# Altium project WT-METER-2CH.PrjPcb (part 2 of 2)

## Sheet [5] - RS485-TRANSCEIVER.SchDoc
size A
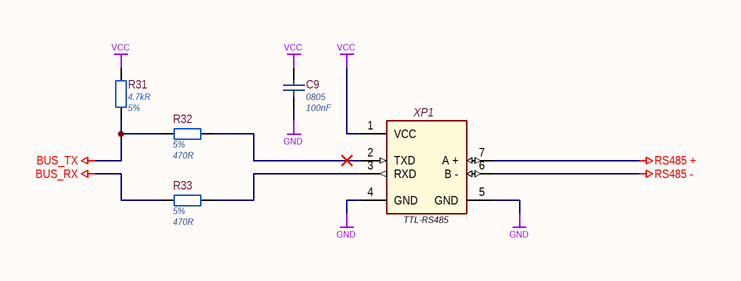
[diagram p3: [5] - RS485-TRANSCEIVER.SchDoc]

### Parts
C9  Case/Package: 0805  Capacitance: 100nF  [CH0805C]  (hidden comment: AC0805KRX7R9BB104)
R31  Resistance: 4.7kR  Tolerance: 5%  [CH0805R]  (hidden comment: RC0805JR-074K7L)
R32  Tolerance: 5%  Resistance: 470R  [CH0805R]  (hidden comment: RC0805JR-07470RL)
R33  Tolerance: 5%  Resistance: 470R  [CH0805R]  (hidden comment: RC0805JR-07470RL)
XP1  TTL-RS485  [TTL-RS485]

### Nets
BUS_RX: R33.1
BUS_TX: R31.2 R32.1
GND: C9.2 XP1.4(GND) XP1.5(GND)
RS485 +: XP1.7(A_+)
RS485 -: XP1.6(B_-)
VCC: C9.1 R31.1 XP1.1(VCC)
NetR32_2: R32.2 XP1.2(TXD)
NetR33_2: R33.2 XP1.3(RXD)

### Library data of the parts
C9 = AC0805KRX7R9BB104: 0.10µF 50V Ceramic Capacitor X7R 0805 (2012 Metric) 0.079" L x 0.049" W (2.00mm x 1.25mm); Manufacturer 1: Yageo; Tolerance: 10%; Supplier 1: Digi-Key; Manufacturer Part Number 1: AC0805KRX7R9BB104; Stock 1: 18765; Pricing 1: 1=0.23000, 10=0.15600, 100=0.07930, 500=0.05424, 1000=0.04799 (USD); RoHS: Yes; Mount: Surface Mount; Min Operating Temperature: -55°C; Max Operating Temperature: 125°C; Packaging: Tape and Reel; Voltage Rating: 50V; Length: 0.079inch; Width: 0.049inch; Thickness: 0.028inch; Ratings: AEC-Q200; Lead Free: Lead Free; ComponentLink1URL: http://www.yageo.com/documents/recent/UPY-AC_NP0X7R_16V-to-630V_12.pdf?src-supplier=Digi-Key; ComponentLink1Description: http://www.yageo.com/documents/recent/UPY-AC_NP0X7R_16V-to-630V_12.pdf?src-supplier=Digi-Key; Supplier Part Number 1: 311-3037-1-ND; Supplier 2: Digi-Key; Supplier Part Number 2: 311-1939-2-ND
R31 = RC0805JR-074K7L: RES SMD 4.7K OHM 5% 1/8W 0805; Manufacturer 1: Yageo; Temperature Coefficient: 100ppm/°C; Power Rating: 125mW; Voltage Rating: 150V; Supplier 1: Digi-Key; Manufacturer Part Number 1: RC0805JR-074K7L; Stock 1: 3389846; Pricing 1: 1=0.10000, 10=0.03600, 100=0.01460, 1000=0.00654, 2500=0.00568 (USD); RoHS: Yes; Case/Package: Molded; Contact Plating: Tin,Lead,Matte; Case Code (Imperial): 0805; Case Code (Metric): 2012; Min Operating Temperature: -55°C; Max Operating Temperature: 155°C; Composition: Thick Film; Packaging: Tape and Reel; Termination: SMD/SMT; Military Standard: Not; Length: 2mm; Depth: 1.25mm; Radiation Hardening: No; REACH SVHC: Unknown; Lead Free: Lead Free; ComponentLink1URL: https://datasheet.ciiva.com/7941/442941-7941974.pdf?src-supplier=Element14; ComponentLink1Description: https://datasheet.ciiva.com/7941/442941-7941974.pdf?src-supplier=Element14; ComponentLink2URL: https://datasheet.ciiva.com/7941/442941-7941973.pdf?src-supplier=Element14; ComponentLink2Description: https://datasheet.ciiva.com/7941/442941-7941973.pdf?src-supplier=Element14; ComponentLink3URL: https://datasheet.ciiva.com/17486/rc0805-17486827.pdf?src-supplier=Future+Electronics; ComponentLink3Description: https://datasheet.ciiva.com/17486/rc0805-17486827.pdf?src-supplier=Future+Electronics; ComponentLink4URL: https://datasheet.ciiva.com/12667/rc0805-12667037.pdf?src-supplier=Mouser; ComponentLink4Description: https://datasheet.ciiva.com/12667/rc0805-12667037.pdf?src-supplier=Mouser; Supplier Part Number 1: 311-4.7KARCT-ND
R32 R33 = RC0805JR-07470RL: RES SMD 470 OHM 5% 1/8W 0805; Manufacturer 1: Yageo; Power Rating: 125mW; Temperature Coefficient: 100ppm/°C; Voltage Rating: 150V; Supplier 1: Digi-Key; Manufacturer Part Number 1: RC0805JR-07470RL; Stock 1: 1884733; Pricing 1: 1=0.10000, 10=0.03600, 100=0.01460, 1000=0.00654, 2500=0.00568 (USD); RoHS: Yes; Case/Package: 0805; Contact Plating: Tin,Matte,Lead; Case Code (Imperial): 0805; Case Code (Metric): 2012; Min Operating Temperature: -55°C; Max Operating Temperature: 155°C; Packaging: Tape and Reel; Composition: Thick Film; Termination: SMD/SMT; Military Standard: Not; Length: 2mm; Depth: 1.25mm; Radiation Hardening: No; REACH SVHC: Unknown; Lead Free: Lead Free; ComponentLink1URL: https://datasheet.ciiva.com/2456/rc080520pb20free-2456048.pdf?src-supplier=Digi-Key; ComponentLink1Description: https://datasheet.ciiva.com/2456/rc080520pb20free-2456048.pdf?src-supplier=Digi-Key; ComponentLink2URL: https://datasheet.ciiva.com/15190/getdatasheetpartid-330937-15190054.pdf?src-supplier=Verical; ComponentLink2Description: https://datasheet.ciiva.com/15190/getdatasheetpartid-330937-15190054.pdf?src-supplier=Verical; ComponentLink3URL: https://datasheet.ciiva.com/12667/rc0805-12667416.pdf?src-supplier=Mouser; ComponentLink3Description: https://datasheet.ciiva.com/12667/rc0805-12667416.pdf?src-supplier=Mouser; ComponentLink4URL: https://datasheet.ciiva.com/16740/rc0805-16740745.pdf?src-supplier=Future+Electronics; ComponentLink4Description: https://datasheet.ciiva.com/16740/rc0805-16740745.pdf?src-supplier=Future+Electronics; ComponentLink5URL: https://datasheet.ciiva.com/7941/442941-7941965.pdf?src-supplier=Element14; ComponentLink5Description: https://datasheet.ciiva.com/7941/442941-7941965.pdf?src-supplier=Element14; ComponentLink6URL: https://datasheet.ciiva.com/7941/442941-7941966.pdf?src-supplier=Element14; ComponentLink6Description: https://datasheet.ciiva.com/7941/442941-7941966.pdf?src-supplier=Element14; ComponentLink7URL: https://datasheet.ciiva.com/46395/444164-46395134.pdf?src-supplier=Element14; ComponentLink7Description: https://datasheet.ciiva.com/46395/444164-46395134.pdf?src-supplier=Element14; Supplier Part Number 1: 311-470ARCT-ND
XP1 = TTL-RS485: UART TTL to RS485 Two-way Converter Module; MPN: *; Manufacturer: *; ComponentLinkURL: https://www.amphenol-icc.com/media/wysiwyg/files/drawing/10051922.pdf; Supplier 1: *; Supplier 2: *; PackageReference: TTL-RS485; Value: TTL-RS485

## Sheet [6] - POWER.SchDoc
size A
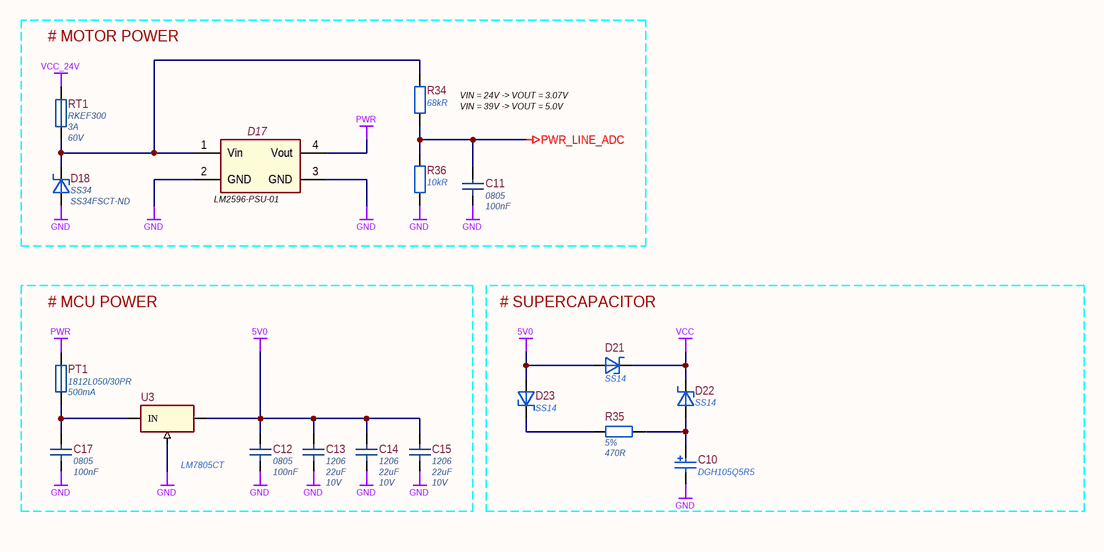
[diagram p4: [6] - POWER.SchDoc]

### Parts
C10  DGH105Q5R5  [DGH105Q5R5]
C11  Case/Package: 0805  Capacitance: 100nF  [CH0805C]  (hidden comment: AC0805KRX7R9BB104)
C12  Case/Package: 0805  Capacitance: 100nF  [CH0805C]  (hidden comment: AC0805KRX7R9BB104)
C13  Case/Package: 1206  Capacitance: 22uF  Voltage Rating: 10V  [CH1206C]  (hidden comment: CC1206KKX5R6BB226)
C14  Case/Package: 1206  Capacitance: 22uF  Voltage Rating: 10V  [CH1206C]  (hidden comment: CC1206KKX5R6BB226)
C15  Case/Package: 1206  Capacitance: 22uF  Voltage Rating: 10V  [CH1206C]  (hidden comment: CC1206KKX5R6BB226)
C17  Case/Package: 0805  Capacitance: 100nF  [CH0805C]  (hidden comment: AC0805KRX7R9BB104)
D17  LM2596-PSU-01  [LM2596-PSU-01]
D18  SS34  Supplier Part Number 1: SS34FSCT-ND  [SMB]
D21  SS14  [SMA]
D22  SS14  [SMA]
D23  SS14  [SMA]
PT1  1812L050/30PR  Hold Current: 500mA  [CH1812F]
R34  Resistance: 68kR  [CH0805R]  (hidden comment: RC0805JR-0768KL)
R35  Tolerance: 5%  Resistance: 470R  [CH0805R]  (hidden comment: RC0805JR-07470RL)
R36  Resistance: 10kR  [CH0805R]  (hidden comment: RC0805JR-0710KL)
RT1  RKEF300  Hold Current: 3A  Voltage Rating: 60V  [RKEF300]
U3  LM7805CT  [TO-220F]

### Blocks framed on the sheet
# MOTOR POWER: C11 D17 D18 R34 R36 RT1
# MCU POWER: C12-C15 C17 PT1 U3
# SUPERCAPACITOR: C10 D21-D23 R35

### Nets
5V0: C12.1 C13.1 C14.1 C15.1 D21.1(A) D23.1(A) U3.3(OUT)
GND: C10.2 C11.2 C12.2 C13.2 C14.2 C15.2 C17.2 D17.2(GND) D17.3(GND) D18.1(A) R36.1 U3.2(GND)
PWR: D17.4(Vout) PT1.1
PWR_LINE_ADC: C11.1 R34.1 R36.2
VCC: D21.2(K) D22.2(K)
VCC_24V: RT1.1
NetC10_1: C10.1 D22.1(A) R35.1
NetC17_1: C17.1 PT1.2 U3.1(IN)
NetD17_1: D17.1(Vin) D18.2(K) R34.2 RT1.2
NetD23_2: D23.2(K) R35.2

### Notes on the sheet
- (near R34) VIN = 24V -> VOUT = 3.07V
  VIN = 39V -> VOUT = 5.0V

### Library data of the parts
C10 = DGH105Q5R5: CAPACITOR 1F -10% +30% 5.5V TH; Manufacturer 1: CDE Illinois Capacitor; Supplier 1: Digi-Key; Manufacturer Part Number 1: DGH105Q5R5; Stock 1: 7797; Pricing 1: 1=2.84000, 10=2.29600, 100=1.75350, 500=1.33600, 1000=1.16900, 2500=1.12725, 5000=1.08550 (USD); RoHS: No; ComponentLink1URL: http://www.illinoiscapacitor.com/pdf/seriesDocuments/DGH%20series.pdf?src-supplier=Digi-Key; ComponentLink1Description: http://www.illinoiscapacitor.com/pdf/seriesDocuments/DGH%20series.pdf?src-supplier=Digi-Key; Supplier Part Number 1: 1572-1771-ND
C11 C12 C17 = AC0805KRX7R9BB104: as C9 on sheet [5] - RS485-TRANSCEIVER; Supplier 1: Digi-Key; Manufacturer Part Number 1: AC0805KRX7R9BB104; Stock 1: 18765; Pricing 1: 1=0.23000, 10=0.15600, 100=0.07930, 500=0.05424, 1000=0.04799 (USD); RoHS: Yes; Mount: Surface Mount; Min Operating Temperature: -55°C; Max Operating Temperature: 125°C; Packaging: Tape and Reel; Voltage Rating: 50V; Length: 0.079inch; Width: 0.049inch; Thickness: 0.028inch; Ratings: AEC-Q200; Lead Free: Lead Free; ComponentLink1URL: http://www.yageo.com/documents/recent/UPY-AC_NP0X7R_16V-to-630V_12.pdf?src-supplier=Digi-Key; ComponentLink1Description: http://www.yageo.com/documents/recent/UPY-AC_NP0X7R_16V-to-630V_12.pdf?src-supplier=Digi-Key; Supplier Part Number 1: 311-3037-1-ND; Supplier 2: Digi-Key; Supplier Part Number 2: 311-1939-2-ND
C13-C15 = CC1206KKX5R6BB226: Cap Ceramic 22uF 10V X5R 10% SMD 1206 85C Blister T/R; Manufacturer 1: Yageo; Supplier 1: Digi-Key; Manufacturer Part Number 1: CC1206KKX5R6BB226; Stock 1: 8000; Pricing 1: 2000=0.23250 (USD); RoHS: Yes; Mount: Surface Mount; Weight: 0.000571oz; Case Code (Imperial): 1206; Case Code (Metric): 3216; Min Operating Temperature: -55°C; Max Operating Temperature: 85°C; Tolerance: 10%; Dielectric: X5R; Packaging: Tape and Reel; Voltage Rating (DC): 10V; Termination: SMD/SMT; Composition: Ceramic; Length: 3.2mm; Depth: 1.6mm; Width: 1.6mm; Thickness: 0.071inch; Radiation Hardening: No; Lead Free: Lead Free; Halogen Free: Halogen Free; ComponentLink1URL: https://datasheet.ciiva.com/13209/upy-gp-np0-16v-to-50v-8-13209975.pdf?src-supplier=Mouser; ComponentLink1Description: https://datasheet.ciiva.com/13209/upy-gp-np0-16v-to-50v-8-13209975.pdf?src-supplier=Mouser; Supplier Part Number 1: 311-1939-2-ND
D17 = LM2596-PSU-01: LM2596 DC-DC Step Down Adjustable PSU Module; MPN: *; Manufacturer: *; Supplier 1: https://www.minikits.com.au/LM2596-PSU-01; Supplier 2: *; PackageReference: LM2596-PSU-01; Value: LM2596-PSU-01; ComponentLink1Description: linck; ComponentLink1URL: https://www.minikits.com.au/LM2596-PSU-01
D18 = SS34: DIODE SCHOTTKY 40V 3A SMC; Manufacturer 1: ON Semiconductor / Fairchild; Element Configuration: Single; Peak Reverse Current: 500uA; Max Forward Surge Current (Ifsm): 100A; Forward Voltage: 500mV; Polarity: Standard; Max Power Dissipation: 2.27W; Number of Elements: 1; Supplier 1: Digi-Key; Manufacturer Part Number 1: SS34; Stock 1: 29298; Pricing 1: 1=0.47000, 10=0.40600, 100=0.30310, 500=0.23816, 1000=0.18403 (USD); RoHS: Yes; Mount: Surface Mount; Case/Package: SMC; Number of Pins: 2; Contact Plating: Tin; Number of Terminals: 2; Min Operating Temperature: -55°C; Max Operating Temperature: 150°C; Packaging: Tape and Reel; Package Quantity: 1; Current Rating: 3A; Voltage Rating (DC): 40V; Forward Current: 3A; Max Repetitive Reverse Voltage (Vrrm): 40V; Output Current: 3A; Peak Non-Repetitive Surge Current: 100A; Average Rectified Current: 3A; Max Reverse Voltage (DC): 40V; Max Surge Current: 100A; Max Reverse Leakage Current: 500uA; Current: 3A; Voltage: 40V; Length: 7.15mm; Height: 2.75mm; Width: 6.25mm; Radiation Hardening: No; Lead Free: Lead Free; REACH SVHC: No SVHC; ComponentLink1URL: https://datasheet.ciiva.com/911/ss34-911088.pdf?src-supplier=Avnet; ComponentLink1Description: https://datasheet.ciiva.com/911/ss34-911088.pdf?src-supplier=Avnet; ComponentLink2URL: https://datasheet.ciiva.com/4715/ss34-197057-4715255.pdf?src-supplier=Mouser; ComponentLink2Description: https://datasheet.ciiva.com/4715/ss34-197057-4715255.pdf?src-supplier=Mouser; ComponentLink3URL: https://datasheet.ciiva.com/34301/1090087-34301975.pdf?src-supplier=Jameco; ComponentLink3Description: https://datasheet.ciiva.com/34301/1090087-34301975.pdf?src-supplier=Jameco; ComponentLink4URL: https://datasheet.ciiva.com/23832/1725604-23832651.pdf?src-supplier=Newark; ComponentLink4Description: https://datasheet.ciiva.com/23832/1725604-23832651.pdf?src-supplier=Newark; ComponentLink5URL: https://datasheet.ciiva.com/34302/1547649-34302462.pdf?src-supplier=Jameco; ComponentLink5Description: https://datasheet.ciiva.com/34302/1547649-34302462.pdf?src-supplier=Jameco; ComponentLink6URL: https://datasheet.ciiva.com/911/ss34-911086.pdf?src-supplier=Digi-Key; ComponentLink6Description: https://datasheet.ciiva.com/911/ss34-911086.pdf?src-supplier=Digi-Key; ComponentLink7URL: https://datasheet.ciiva.com/8300/ss39-8300583.pdf?src-supplier=Avnet; ComponentLink7Description: https://datasheet.ciiva.com/8300/ss39-8300583.pdf?src-supplier=Avnet; ComponentLink8URL: https://datasheet.ciiva.com/911/ss34-911085.pdf?src-supplier=Digi-Key; ComponentLink8Description: https://datasheet.ciiva.com/911/ss34-911085.pdf?src-supplier=Digi-Key; ComponentLink9URL: https://datasheet.ciiva.com/7965/1774678-7965245.pdf?src-supplier=Element14; ComponentLink9Description: https://datasheet.ciiva.com/7965/1774678-7965245.pdf?src-supplier=Element14; ComponentLink10URL: https://datasheet.ciiva.com/911/ss34-911087.pdf?src-supplier=Digi-Key; ComponentLink10Description: https://datasheet.ciiva.com/911/ss34-911087.pdf?src-supplier=Digi-Key
D21-D23 = SS14: ON SEMICONDUCTOR - SS14 - DIODE, SCHOTTKY, 1A, 40V, DO-214AC-2; Manufacturer 1: ON Semiconductor / Fairchild; Element Configuration: Single; Forward Voltage: 500mV; Peak Reverse Current: 200uA; Max Forward Surge Current (Ifsm): 40A; Polarity: Standard; Max Power Dissipation: 1.1W; Number of Elements: 1; Supplier 1: Digi-Key; Manufacturer Part Number 1: SS14; Stock 1: 334358; Pricing 1: 1=0.39000, 10=0.31900, 100=0.16910, 500=0.11122, 1000=0.07563 (USD); RoHS: Yes; Mount: Surface Mount; Case/Package: SMA; Number of Pins: 2; Weight: 0.003739oz; Number of Terminals: 2; Min Operating Temperature: -65°C; Max Operating Temperature: 125°C; Packaging: Tape and Reel; Package Quantity: 7500; Max Repetitive Reverse Voltage (Vrrm): 40V; Forward Current: 1A; Current Rating: 1A; Peak Non-Repetitive Surge Current: 40A; Voltage Rating (DC): 40V; Termination: SMD/SMT; Average Rectified Current: 1A; Max Reverse Voltage (DC): 40V; Output Current: 1A; Current: 1A; Voltage: 40V; Power Dissipation: 1.1W; Length: 4.75mm; Height: 2.2mm; Width: 2.95mm; Radiation Hardening: No; Lead Free: Lead Free; REACH SVHC: No SVHC; ComponentLink1URL: https://datasheet.ciiva.com/4713/ss14-197224-4713938.pdf?src-supplier=Mouser; ComponentLink1Description: https://datasheet.ciiva.com/4713/ss14-197224-4713938.pdf?src-supplier=Mouser; ComponentLink2URL: https://datasheet.ciiva.com/8303/ss19-8303766.pdf?src-supplier=Avnet; ComponentLink2Description: https://datasheet.ciiva.com/8303/ss19-8303766.pdf?src-supplier=Avnet; ComponentLink3URL: https://datasheet.ciiva.com/910/ss12-910695.pdf?src-supplier=Digi-Key; ComponentLink3Description: https://datasheet.ciiva.com/910/ss12-910695.pdf?src-supplier=Digi-Key; ComponentLink4URL: https://datasheet.ciiva.com/910/ss12-910696.pdf?src-supplier=Digi-Key; ComponentLink4Description: https://datasheet.ciiva.com/910/ss12-910696.pdf?src-supplier=Digi-Key; ComponentLink5URL: https://datasheet.ciiva.com/25951/ss19-25951496.pdf?src-supplier=Avnet+Europe; ComponentLink5Description: https://datasheet.ciiva.com/25951/ss19-25951496.pdf?src-supplier=Avnet+Europe; ComponentLink6URL: https://datasheet.ciiva.com/910/ss12-910697.pdf?src-supplier=Digi-Key; ComponentLink6Description: https://datasheet.ciiva.com/910/ss12-910697.pdf?src-supplier=Digi-Key; ComponentLink7URL: https://datasheet.ciiva.com/7965/1766303-7965241.pdf?src-supplier=Element14; ComponentLink7Description: https://datasheet.ciiva.com/7965/1766303-7965241.pdf?src-supplier=Element14; ComponentLink8URL: https://datasheet.ciiva.com/22651/1880990-22651980.pdf?src-supplier=Element14; ComponentLink8Description: https://datasheet.ciiva.com/22651/1880990-22651980.pdf?src-supplier=Element14; Supplier Part Number 1: SS14CT-ND
PT1 = 1812L050/30PR: PTC RESET FUSE 30V 500MA 1812; Manufacturer 1: Littelfuse; Max Current Rating: 100A; Resistance: 1R; Power Dissipation: 800mW; Trip Current: 1A; Time to Trip: 0.15s; Approvals: cULus,TUV; Supplier 1: Digi-Key; Manufacturer Part Number 1: 1812L050/30PR; Stock 1: 29645; Pricing 1: 1=1.00000, 5=0.97200, 10=0.90900, 50=0.75240, 100=0.62700, 250=0.61132, 500=0.51728, 1000=0.45458 (USD); RoHS: Yes; Case/Package: 1812; Case Code (Metric): 4532; Case Code (Imperial): 1812; Min Operating Temperature: -40°C; Max Operating Temperature: 85°C; Packaging: Tape and Reel; Current Rating: 100A; Package Quantity: 2000; Termination: SMD/SMT; Max Voltage Rating (DC): 30V; Working Voltage: 30V; Voltage Rating (DC): 30V; REACH SVHC: Unknown; Lead Free: Lead Free; ComponentLink1URL: https://datasheet.ciiva.com/326/littelfuse-ptc-1812l-326064.pdf?src-supplier=Digi-Key; ComponentLink1Description: https://datasheet.ciiva.com/326/littelfuse-ptc-1812l-326064.pdf?src-supplier=Digi-Key; ComponentLink2URL: https://datasheet.ciiva.com/326/littelfuse-ptc-1812l-326063.pdf?src-supplier=Digi-Key; ComponentLink2Description: https://datasheet.ciiva.com/326/littelfuse-ptc-1812l-326063.pdf?src-supplier=Digi-Key; ComponentLink3URL: https://datasheet.ciiva.com/326/littelfuse-ptc-1812l-326065.pdf?src-supplier=Digi-Key; ComponentLink3Description: https://datasheet.ciiva.com/326/littelfuse-ptc-1812l-326065.pdf?src-supplier=Digi-Key; ComponentLink4URL: https://datasheet.ciiva.com/16499/littelfuse-ptc-1812l-16499880.pdf?src-supplier=Future+Electronics; ComponentLink4Description: https://datasheet.ciiva.com/16499/littelfuse-ptc-1812l-16499880.pdf?src-supplier=Future+Electronics; ComponentLink5URL: https://datasheet.ciiva.com/12544/littelfuse-ptc-1812l-12544459.pdf?src-supplier=Mouser; ComponentLink5Description: https://datasheet.ciiva.com/12544/littelfuse-ptc-1812l-12544459.pdf?src-supplier=Mouser; Supplier Part Number 1: F4159CT-ND
R34 = RC0805JR-0768KL: Res Thick Film 0805 68K Ohm 5% 0.125W(1/8W) ±100ppm/C Epoxy Pad SMD T/R; Manufacturer 1: Yageo; Temperature Coefficient: 100ppm/°C; Power Rating: 125mW; Voltage Rating: 150V; Supplier 1: Digi-Key; Manufacturer Part Number 1: RC0805JR-0768KL; Stock 1: 260234; Pricing 1: 1=0,10000, 10=0,03600, 100=0,01460, 1000=0,00654, 2500=0,00568 (USD); RoHS: Yes; Case/Package: 0805; Number of Pins: 2; Weight: 0.000194oz; Contact Plating: Tin,Lead,Matte; Case Code (Metric): 2012; Case Code (Imperial): 0805; Min Operating Temperature: -55°C; Max Operating Temperature: 155°C; Tolerance: 5%; Composition: Thick Film; Package Quantity: 1; Packaging: Tape and Reel; Voltage Rating (DC): 150V; Number of Terminations: 2; Termination: SMD/SMT; Military Standard: Not; Max Power Dissipation: 125mW; Working Voltage: 150V; Features: Moisture Resistant; Length: 2mm; Height: 0.024inch; Width: 1.25mm; Depth: 1.25mm; Radiation Hardening: No; REACH SVHC: No SVHC; Lead Free: Lead Free; ComponentLink1URL: https://datasheet.ciiva.com/16740/rc0805-16740918.pdf?src-supplier=Future+Electronics; ComponentLink1Description: https://datasheet.ciiva.com/16740/rc0805-16740918.pdf?src-supplier=Future+Electronics; ComponentLink2URL: https://datasheet.ciiva.com/7941/442941-7941991.pdf?src-supplier=Element14; ComponentLink2Description: https://datasheet.ciiva.com/7941/442941-7941991.pdf?src-supplier=Element14; ComponentLink3URL: https://datasheet.ciiva.com/7941/442941-7941992.pdf?src-supplier=Element14; ComponentLink3Description: https://datasheet.ciiva.com/7941/442941-7941992.pdf?src-supplier=Element14; ComponentLink4URL: https://datasheet.ciiva.com/5562/rc0805-5562829.pdf?src-supplier=Mouser; ComponentLink4Description: https://datasheet.ciiva.com/5562/rc0805-5562829.pdf?src-supplier=Mouser; ComponentLink5URL: https://datasheet.ciiva.com/2519/pyu-r-int-thick-7-2519234.pdf?src-supplier=Digi-Key; ComponentLink5Description: https://datasheet.ciiva.com/2519/pyu-r-int-thick-7-2519234.pdf?src-supplier=Digi-Key; ComponentLink6URL: https://datasheet.ciiva.com/2519/pyu-r-int-thick-7-2519235.pdf?src-supplier=Digi-Key; ComponentLink6Description: https://datasheet.ciiva.com/2519/pyu-r-int-thick-7-2519235.pdf?src-supplier=Digi-Key; ComponentLink7URL: https://datasheet.ciiva.com/2519/pyu-r-int-thick-7-2519236.pdf?src-supplier=Digi-Key; ComponentLink7Description: https://datasheet.ciiva.com/2519/pyu-r-int-thick-7-2519236.pdf?src-supplier=Digi-Key; ComponentLink8URL: https://datasheet.ciiva.com/6068/442941-6068311.pdf?src-supplier=Farnell; ComponentLink8Description: https://datasheet.ciiva.com/6068/442941-6068311.pdf?src-supplier=Farnell; ComponentLink9URL: https://datasheet.ciiva.com/6068/442941-6068312.pdf?src-supplier=Farnell; ComponentLink9Description: https://datasheet.ciiva.com/6068/442941-6068312.pdf?src-supplier=Farnell; Supplier Part Number 1: 311-68KARCT-ND
R35 = RC0805JR-07470RL: as R32 on sheet [5] - RS485-TRANSCEIVER; Supplier 1: Digi-Key; Manufacturer Part Number 1: RC0805JR-07470RL; Stock 1: 1884733; Pricing 1: 1=0.10000, 10=0.03600, 100=0.01460, 1000=0.00654, 2500=0.00568 (USD); RoHS: Yes; Case/Package: 0805; Contact Plating: Tin,Matte,Lead; Case Code (Imperial): 0805; Case Code (Metric): 2012; Min Operating Temperature: -55°C; Max Operating Temperature: 155°C; Packaging: Tape and Reel; Composition: Thick Film; Termination: SMD/SMT; Military Standard: Not; Length: 2mm; Depth: 1.25mm; Radiation Hardening: No; REACH SVHC: Unknown; Lead Free: Lead Free; ComponentLink1URL: https://datasheet.ciiva.com/2456/rc080520pb20free-2456048.pdf?src-supplier=Digi-Key; ComponentLink1Description: https://datasheet.ciiva.com/2456/rc080520pb20free-2456048.pdf?src-supplier=Digi-Key; ComponentLink2URL: https://datasheet.ciiva.com/15190/getdatasheetpartid-330937-15190054.pdf?src-supplier=Verical; ComponentLink2Description: https://datasheet.ciiva.com/15190/getdatasheetpartid-330937-15190054.pdf?src-supplier=Verical; ComponentLink3URL: https://datasheet.ciiva.com/12667/rc0805-12667416.pdf?src-supplier=Mouser; ComponentLink3Description: https://datasheet.ciiva.com/12667/rc0805-12667416.pdf?src-supplier=Mouser; ComponentLink4URL: https://datasheet.ciiva.com/16740/rc0805-16740745.pdf?src-supplier=Future+Electronics; ComponentLink4Description: https://datasheet.ciiva.com/16740/rc0805-16740745.pdf?src-supplier=Future+Electronics; ComponentLink5URL: https://datasheet.ciiva.com/7941/442941-7941965.pdf?src-supplier=Element14; ComponentLink5Description: https://datasheet.ciiva.com/7941/442941-7941965.pdf?src-supplier=Element14; ComponentLink6URL: https://datasheet.ciiva.com/7941/442941-7941966.pdf?src-supplier=Element14; ComponentLink6Description: https://datasheet.ciiva.com/7941/442941-7941966.pdf?src-supplier=Element14; ComponentLink7URL: https://datasheet.ciiva.com/46395/444164-46395134.pdf?src-supplier=Element14; ComponentLink7Description: https://datasheet.ciiva.com/46395/444164-46395134.pdf?src-supplier=Element14; Supplier Part Number 1: 311-470ARCT-ND
R36 = RC0805JR-0710KL: RES SMD 10K OHM 5% 1/8W 0805; Manufacturer 1: Yageo; Power Rating: 125mW; Temperature Coefficient: 100ppm/°C; Voltage Rating: 150V; Supplier 1: Digi-Key; Manufacturer Part Number 1: RC0805JR-0710KL; Pricing 1: 1=0.10000, 10=0.03600, 100=0.01460, 1000=0.00654, 2500=0.00568 (USD); Case/Package: 0805; Contact Plating: Tin,Matte; Case Code (Imperial): 0805; Case Code (Metric): 2012; Min Operating Temperature: -55°C; Max Operating Temperature: 155°C; Composition: Thick Film; Tolerance: 5%; Packaging: Tape and Reel; Termination: SMD/SMT; Military Standard: Not; Length: 2mm; Height: 0.5mm; Width: 1.25mm; Depth: 1.25mm; Radiation Hardening: No; REACH SVHC: Unknown; Lead Free: Lead Free; ComponentLink1URL: https://datasheet.ciiva.com/7983/444164-7983765.pdf?src-supplier=Element14; ComponentLink1Description: https://datasheet.ciiva.com/7983/444164-7983765.pdf?src-supplier=Element14; ComponentLink2URL: https://datasheet.ciiva.com/7941/444164-7941870.pdf?src-supplier=Element14; ComponentLink2Description: https://datasheet.ciiva.com/7941/444164-7941870.pdf?src-supplier=Element14; ComponentLink3URL: https://datasheet.ciiva.com/7941/444164-7941871.pdf?src-supplier=Element14; ComponentLink3Description: https://datasheet.ciiva.com/7941/444164-7941871.pdf?src-supplier=Element14; Supplier Part Number 1: 311-10KARCT-ND; Stock 1: 13413905; RoHS: Yes
RT1 = RKEF300: TE Connectivity 3A Radial Leaded PCB Mount Resettable Fuse, 60 V; Max Current Rating: 40A; Trip Current: 6A; Power Dissipation: 3.2W; Time to Trip: 19.8s; Resistance: 80mR; Lead/Base Style: Straight; Approvals: UL,CSA,TUV; Supplier 1: Newark; Manufacturer 1: TE Connectivity; Manufacturer Part Number 1: RKEF300; Stock 1: 0; RoHS: Yes; Mount: Through Hole; Case/Package: Radial; Number of Terminals: 2; Min Operating Temperature: -40°C; Max Operating Temperature: 85°C; Packaging: Bulk; Package Quantity: 1000; Current Rating: 40A; Termination: Radial; Voltage Rating (DC): 60V; Lead Pitch: 5.8mm; REACH SVHC: No SVHC; ComponentLink1URL: https://datasheet.ciiva.com/327/eng-ss-scd26930-d-327281.pdf?src-supplier=Digi-Key; ComponentLink1Description: https://datasheet.ciiva.com/327/eng-ss-scd26930-d-327281.pdf?src-supplier=Digi-Key; ComponentLink2URL: https://datasheet.ciiva.com/16207/eng-ss-scd26930-d-16207261.pdf?src-supplier=Onlinecomponents.com; ComponentLink2Description: https://datasheet.ciiva.com/16207/eng-ss-scd26930-d-16207261.pdf?src-supplier=Onlinecomponents.com; ComponentLink3URL: https://datasheet.ciiva.com/39124/eng-cs-clp00011-a-clp00011-39124655.pdf?src-supplier=Onlinecomponents.com; ComponentLink3Description: https://datasheet.ciiva.com/39124/eng-cs-clp00011-a-clp00011-39124655.pdf?src-supplier=Onlinecomponents.com; Supplier Part Number 1: 22AC8552
U3 = LM7805CT: FAIRCHILD SEMICONDUCTOR         LM7805CT.             Linear Voltage Regulator, 7805, Fixed, Positive Output, 10V To 35V In, 5V And 1A Out, TO-220-3; Manufacturer 1: ON Semiconductor / Fairchild; Quiescent Current: 8mA; Dropout Voltage: 2V; Number of Outputs: 1; Min Input Voltage: 7V; Accuracy: 4%; Power Supply Rejection Ratio (PSRR): 73dB; Max Output Voltage: 5.2V; Supplier 1: Avnet; Manufacturer Part Number 1: LM7805CT; Stock 1: 186196; RoHS: Yes; Mount: Through Hole; Case/Package: TO-220-3; Number of Pins: 3; Weight: 1.214g; Min Operating Temperature: -40°C; Max Operating Temperature: 125°C; Output Voltage: 5V; Output Type: Fixed; Packaging: Rail/Tube; Max Input Voltage: 35V; Output Current: 1A; Polarity: Positive; Package Quantity: 50; Max Output Current: 1A; Number of Regulators: 1; Output Voltage Accuracy: 4%; Current Rating: 1A; Nominal Output Voltage: 5V; Min Output Voltage: 5V; Length: 10.67mm; Height: 16.3mm; Width: 4.7mm; Radiation Hardening: No; Lead Free: Lead Free; REACH SVHC: No SVHC; ComponentLink1URL: https://datasheet.ciiva.com/19456/786138-19456361.pdf?src-supplier=Jameco; ComponentLink1Description: https://datasheet.ciiva.com/19456/786138-19456361.pdf?src-supplier=Jameco; ComponentLink2URL: https://datasheet.ciiva.com/26904/lm7805ct-26904988.pdf?src-supplier=IIIC; ComponentLink2Description: https://datasheet.ciiva.com/26904/lm7805ct-26904988.pdf?src-supplier=IIIC; ComponentLink3URL: https://datasheet.ciiva.com/8239/lm7812-8239478.pdf?src-supplier=Avnet; ComponentLink3Description: https://datasheet.ciiva.com/8239/lm7812-8239478.pdf?src-supplier=Avnet; ComponentLink4URL: https://datasheet.ciiva.com/17332/lm7805-17332792.pdf?src-supplier=Future+Electronics; ComponentLink4Description: https://datasheet.ciiva.com/17332/lm7805-17332792.pdf?src-supplier=Future+Electronics; ComponentLink5URL: https://datasheet.ciiva.com/1512/1855686-1512105.pdf?src-supplier=Element14; ComponentLink5Description: https://datasheet.ciiva.com/1512/1855686-1512105.pdf?src-supplier=Element14; ComponentLink6URL: https://datasheet.ciiva.com/2039/lm7805-2039365.pdf?src-supplier=Digi-Key; ComponentLink6Description: https://datasheet.ciiva.com/2039/lm7805-2039365.pdf?src-supplier=Digi-Key; ComponentLink7URL: https://datasheet.ciiva.com/1512/1855686-1512106.pdf?src-supplier=Element14; ComponentLink7Description: https://datasheet.ciiva.com/1512/1855686-1512106.pdf?src-supplier=Element14; ComponentLink8URL: https://datasheet.ciiva.com/1511/1855686-1511835.pdf?src-supplier=Element14; ComponentLink8Description: https://datasheet.ciiva.com/1511/1855686-1511835.pdf?src-supplier=Element14; ComponentLink9URL: https://datasheet.ciiva.com/48694/001253095-da-01-en-ic-reg-ldo-5v-1a-lm7805ct-to-220-3-fsc-48694790.pdf?src-supplier=Conrad; ComponentLink9Description: https://datasheet.ciiva.com/48694/001253095-da-01-en-ic-reg-ldo-5v-1a-lm7805ct-to-220-3-fsc-48694790.pdf?src-supplier=Conrad; Supplier Part Number 1: LM7805CT

## Sheet [7] - CONNECTORS.SchDoc
size A
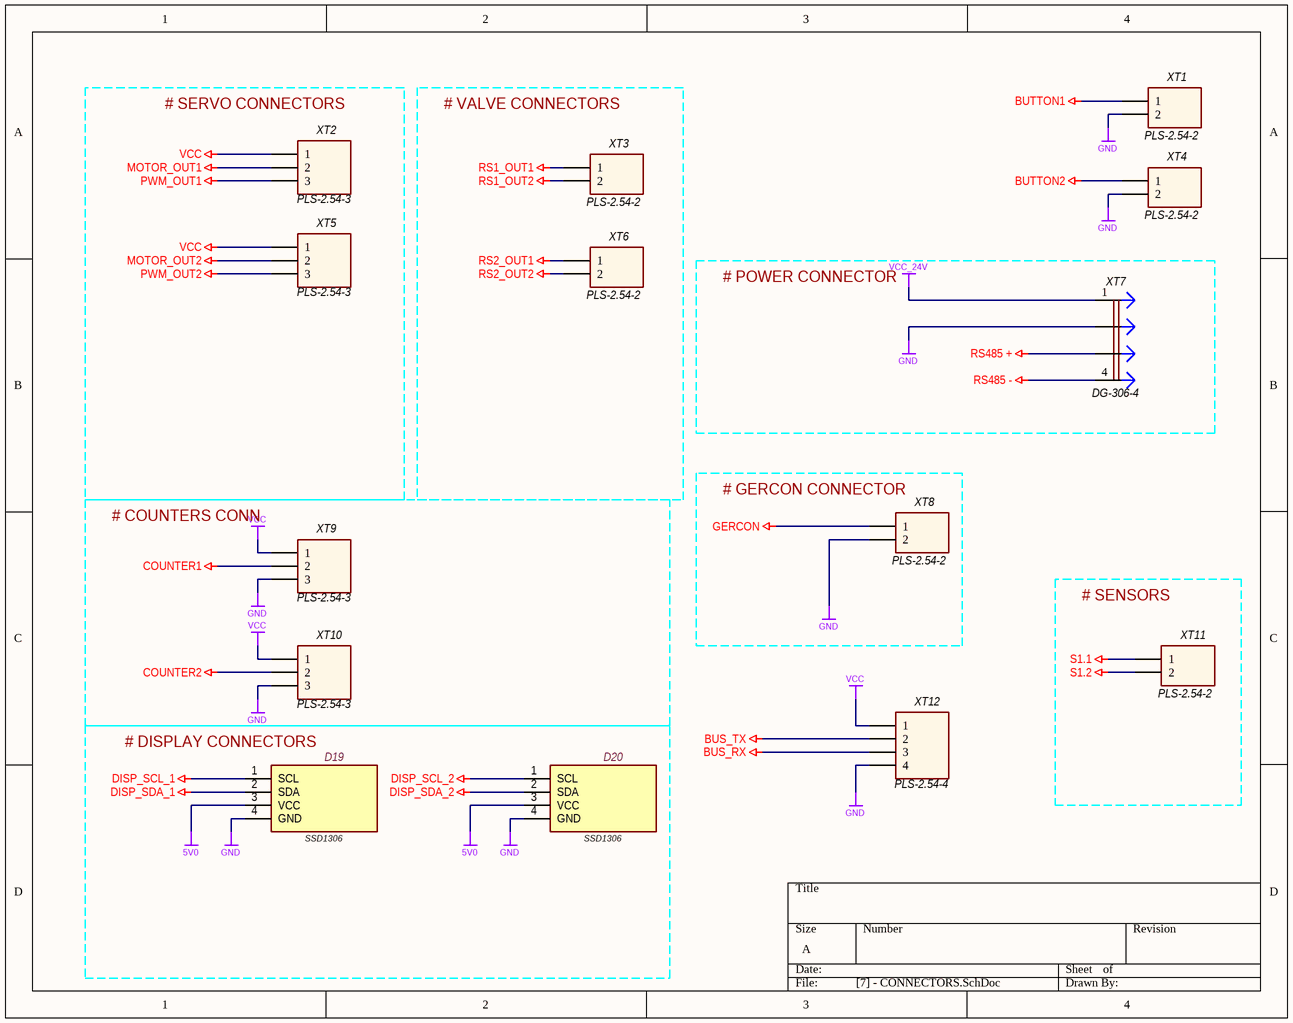
[diagram p5: [7] - CONNECTORS.SchDoc]

### Parts
D19  SSD1306  [SSD1306]
D20  SSD1306  [SSD1306]
XT1  PLS-2.54-2  [J1x2]
XT2  PLS-2.54-3  [J1x3]
XT3  PLS-2.54-2  [J1x2]
XT4  PLS-2.54-2  [J1x2]
XT5  PLS-2.54-3  [J1x3]
XT6  PLS-2.54-2  [J1x2]
XT7  DG-306-4
XT8  PLS-2.54-2  [J1x2]
XT9  PLS-2.54-3  [J1x3]
XT10  PLS-2.54-3  [J1x3]
XT11  PLS-2.54-2  [J1x2]
XT12  PLS-2.54-4  [J1x4]

### Blocks framed on the sheet
# SERVO CONNECTORS: XT2 XT5
# VALVE CONNECTORS: XT3 XT6
# POWER CONNECTOR: XT7
# COUNTERS CONN: XT9 XT10
# GERCON CONNECTOR: XT8
# SENSORS: XT11
# DISPLAY CONNECTORS: D19 D20

### Nets
5V0: D19.3(VCC) D20.3(VCC)
BUS_RX: XT12.3
BUS_TX: XT12.2
BUTTON1: XT1.1
BUTTON2: XT4.1
COUNTER1: XT9.2
COUNTER2: XT10.2
DISP_SCL_1: D19.1(SCL)
DISP_SCL_2: D20.1(SCL)
DISP_SDA_1: D19.2(SDA)
DISP_SDA_2: D20.2(SDA)
GERCON: XT8.1
GND: D19.4(GND) D20.4(GND) XT1.2 XT4.2 XT7.2 XT8.2 XT9.3 XT10.3 XT12.4
MOTOR_OUT1: XT2.2
MOTOR_OUT2: XT5.2
PWM_OUT1: XT2.3
PWM_OUT2: XT5.3
RS1_OUT1: XT3.1
RS1_OUT2: XT3.2
RS2_OUT1: XT6.1
RS2_OUT2: XT6.2
RS485 +: XT7.3
RS485 -: XT7.4
S1.1: XT11.1
S1.2: XT11.2
VCC: XT2.1 XT5.1 XT9.1 XT10.1 XT12.1
VCC_24V: XT7.1

### Library data of the parts
D19 D20 = SSD1306: 0.91″ min OLED display screen with 128X32 resoluction and SSD1306 chipset; MPN: SSD1306; Manufacturer: *; Supplier 1: *; Supplier 2: *; PackageReference: *; Value: SSD1306
XT1 XT3 XT4 XT6 XT8 XT11 = PLS-2.54-2: Header Connector  2.54 mm; Manufacturer: *; Supplier 1: *; ComponentLinkURL: *; ComponentLinkDescription: *; Supplier 2: *; PackageReference: *; MPN: *; Value: PLS-2.54-2
XT2 XT5 XT9 XT10 = PLS-2.54-3: Header Connector  2.54 mm; Manufacturer: *; Supplier 1: *; ComponentLinkURL: *; ComponentLinkDescription: *; Supplier 2: *; PackageReference: *; MPN: *; Value: PLS-2.54-3
XT7 = DG-306-4: Terminal Block 5.08mm; Manufacturer: *; Supplier 1: *; ComponentLinkURL: *; ComponentLinkDescription: *; Supplier 2: *; PackageReference: *; MPN: *; Value: DG-306-4
XT12 = PLS-2.54-4: Header Connector  2.54 mm; Manufacturer: *; Supplier 1: *; ComponentLinkURL: *; ComponentLinkDescription: *; Supplier 2: *; PackageReference: *; MPN: *; Value: PLS-2.54-4

## Sheet [8] - SENSORLESS.SchDoc
size A
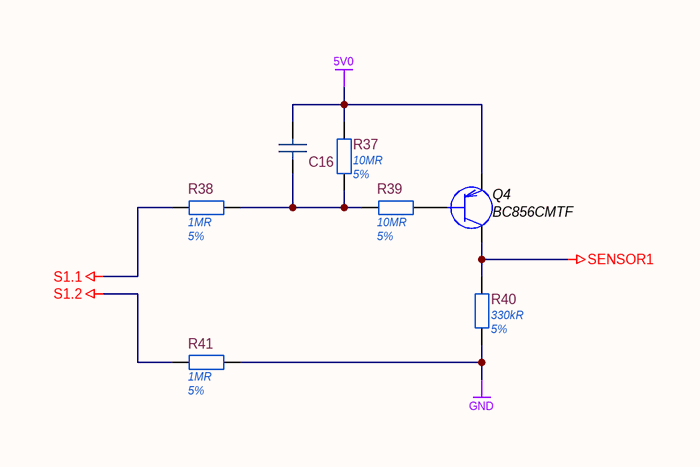
[diagram p6: [8] - SENSORLESS.SchDoc]

### Parts
C16  AC0805KRX7R9BB103  [CH0805C]  (value not drawn)
Q4  BC856CMTF  [SOT23-3]
R37  Resistance: 10MR  Tolerance: 5%  [CH0805R]  (hidden comment: RC0805JR-0710ML)
R38  Resistance: 1MR  Tolerance: 5%  [CH0805R]  (hidden comment: RC0805JR-071ML)
R39  Resistance: 10MR  Tolerance: 5%  [CH0805R]  (hidden comment: RC0805JR-0710ML)
R40  Resistance: 330kR  Tolerance: 5%  [CH0805R]  (hidden comment: RC0805JR-07330KL)
R41  Resistance: 1MR  Tolerance: 5%  [CH0805R]  (hidden comment: RC0805JR-071ML)

### Nets
5V0: C16.1 Q4.2(B) R37.2
GND: R40.1 R41.2
S1.1: R38.1
S1.2: R41.1
SENSOR1: Q4.3(B) R40.2
NetC16_2: C16.2 R37.1 R38.2 R39.2
NetQ4_1: Q4.1(B) R39.1

### Library data of the parts
C16 = AC0805KRX7R9BB103: CAP CER 10000PF 50V X7R 0805; Manufacturer 1: Yageo; Supplier 1: Digi-Key; Manufacturer Part Number 1: AC0805KRX7R9BB103; Stock 1: 13850; Pricing 1: 1=0,20000, 10=0,13800, 100=0,07000, 500=0,04792, 1000=0,04238 (USD); RoHS: No; Lead Free: Lead Free; ComponentLink1URL: http://www.yageo.com/NewPortal/_en/search/productDocs.jsp?YageoPartNumber=AC0805KRX7R9BB103&src-supplier=Digi-Key; ComponentLink1Description: http://www.yageo.com/NewPortal/_en/search/productDocs.jsp?YageoPartNumber=AC0805KRX7R9BB103&src-supplier=Digi-Key; Supplier Part Number 1: 311-3174-1-ND
Q4 = BC856CMTF: TRANS PNP 65V 0.1A SOT-23; Manufacturer: ON Semiconductor; MPN: BC856CMTF; Supplier 1: Digi-Key; Supplier 2: *; PackageReference: SOT-23-3; Value: BC856CMTF
R37 R39 = RC0805JR-0710ML: RES SMD 10M OHM 5% 1/8W 0805; Manufacturer 1: Yageo; Temperature Coefficient: 100ppm/°C; Power Rating: 125mW; Voltage Rating: 150V; Supplier 1: Digi-Key; Manufacturer Part Number 1: RC0805JR-0710ML; Stock 1: 307176; Pricing 1: 1=0,10000, 10=0,03600, 100=0,01460, 1000=0,00654, 2500=0,00568 (USD); RoHS: Yes; Case/Package: 0805; Contact Plating: Tin,Matte,Lead; Case Code (Imperial): 0805; Case Code (Metric): 2012; Min Operating Temperature: -55°C; Max Operating Temperature: 155°C; Composition: Thick Film; Packaging: Tape and Reel; Package Quantity: 1; Termination: SMD/SMT; Number of Terminations: 2; Military Standard: Not; Max Power Dissipation: 125mW; Features: Moisture Resistant; Length: 0.079inch; Height: 0.024inch; Width: 0.049inch; Depth: 1.25mm; Radiation Hardening: No; REACH SVHC: Unknown; Lead Free: Lead Free; ComponentLink1URL: https://datasheet.ciiva.com/12667/rc0805-12667352.pdf?src-supplier=Mouser; ComponentLink1Description: https://datasheet.ciiva.com/12667/rc0805-12667352.pdf?src-supplier=Mouser; ComponentLink2URL: https://datasheet.ciiva.com/2456/pyu-r-int-thick-7-2456140.pdf?src-supplier=Digi-Key; ComponentLink2Description: https://datasheet.ciiva.com/2456/pyu-r-int-thick-7-2456140.pdf?src-supplier=Digi-Key; ComponentLink3URL: https://datasheet.ciiva.com/2456/pyu-r-int-thick-7-2456141.pdf?src-supplier=Digi-Key; ComponentLink3Description: https://datasheet.ciiva.com/2456/pyu-r-int-thick-7-2456141.pdf?src-supplier=Digi-Key; ComponentLink4URL: https://datasheet.ciiva.com/2456/pyu-r-int-thick-7-2456142.pdf?src-supplier=Digi-Key; ComponentLink4Description: https://datasheet.ciiva.com/2456/pyu-r-int-thick-7-2456142.pdf?src-supplier=Digi-Key; Supplier Part Number 1: 311-10MARCT-ND
R38 R41 = RC0805JR-071ML: RES SMD 1M OHM 5% 1/8W 0805; Manufacturer 1: Yageo; Temperature Coefficient: 100ppm/°C; Power Rating: 125mW; Voltage Rating: 150V; Supplier 1: Digi-Key; Manufacturer Part Number 1: RC0805JR-071ML; Stock 1: 1427349; Pricing 1: 1=0,10000, 10=0,03600, 100=0,01460, 1000=0,00654, 2500=0,00568 (USD); RoHS: Yes; Case/Package: 0805; Case Code (Imperial): 0805; Case Code (Metric): 2012; Contact Plating: Tin,Lead,Matte; Min Operating Temperature: -55°C; Max Operating Temperature: 155°C; Composition: Thick Film; Packaging: Tape and Reel; Package Quantity: 1; Termination: SMD/SMT; Number of Terminations: 2; Military Standard: Not; Max Power Dissipation: 125mW; Features: Moisture Resistant; Length: 0.079inch; Height: 0.024inch; Width: 0.049inch; Depth: 1.25mm; Radiation Hardening: No; REACH SVHC: Unknown; Lead Free: Lead Free; ComponentLink1URL: https://datasheet.ciiva.com/2519/pyu-r-int-thick-7-2519301.pdf?src-supplier=Digi-Key; ComponentLink1Description: https://datasheet.ciiva.com/2519/pyu-r-int-thick-7-2519301.pdf?src-supplier=Digi-Key; ComponentLink2URL: https://datasheet.ciiva.com/2519/pyu-r-int-thick-7-2519302.pdf?src-supplier=Digi-Key; ComponentLink2Description: https://datasheet.ciiva.com/2519/pyu-r-int-thick-7-2519302.pdf?src-supplier=Digi-Key; ComponentLink3URL: https://datasheet.ciiva.com/16796/rc0805-16796344.pdf?src-supplier=Future+Electronics; ComponentLink3Description: https://datasheet.ciiva.com/16796/rc0805-16796344.pdf?src-supplier=Future+Electronics; ComponentLink4URL: https://datasheet.ciiva.com/7941/442941-7941913.pdf?src-supplier=Element14; ComponentLink4Description: https://datasheet.ciiva.com/7941/442941-7941913.pdf?src-supplier=Element14; ComponentLink5URL: https://datasheet.ciiva.com/7941/442941-7941914.pdf?src-supplier=Element14; ComponentLink5Description: https://datasheet.ciiva.com/7941/442941-7941914.pdf?src-supplier=Element14; ComponentLink6URL: https://datasheet.ciiva.com/46395/444164-46395132.pdf?src-supplier=Element14; ComponentLink6Description: https://datasheet.ciiva.com/46395/444164-46395132.pdf?src-supplier=Element14; Supplier Part Number 1: 311-1.0MARCT-ND
R40 = RC0805JR-07330KL: RES SMD 330K OHM 5% 1/8W 0805; Manufacturer 1: Yageo; Temperature Coefficient: 100ppm/°C; Power Rating: 125mW; Voltage Rating: 150V; Supplier 1: Digi-Key; Manufacturer Part Number 1: RC0805JR-07330KL; Stock 1: 141358; Pricing 1: 1=0,10000, 10=0,03600, 100=0,01460, 1000=0,00654, 2500=0,00568 (USD); RoHS: Yes; Case/Package: 0805; Number of Pins: 2; Contact Plating: Tin,Matte,Lead; Case Code (Imperial): 0805; Case Code (Metric): 2012; Min Operating Temperature: -55°C; Max Operating Temperature: 155°C; Composition: Thick Film; Packaging: Tape and Reel; Voltage Rating (DC): 150V; Package Quantity: 1; Termination: SMD/SMT; Number of Terminations: 2; Military Standard: Not; Max Power Dissipation: 125mW; Features: Moisture Resistant; Length: 0.079inch; Height: 0.024inch; Width: 0.049inch; Depth: 1.25mm; Radiation Hardening: No; REACH SVHC: No SVHC; Lead Free: Lead Free; ComponentLink1URL: https://datasheet.ciiva.com/5557/rc0805-5557968.pdf?src-supplier=Mouser; ComponentLink1Description: https://datasheet.ciiva.com/5557/rc0805-5557968.pdf?src-supplier=Mouser; ComponentLink2URL: https://datasheet.ciiva.com/2456/pyu-r-int-thick-7-2456375.pdf?src-supplier=Digi-Key; ComponentLink2Description: https://datasheet.ciiva.com/2456/pyu-r-int-thick-7-2456375.pdf?src-supplier=Digi-Key; ComponentLink3URL: https://datasheet.ciiva.com/17332/rc0805-17332090.pdf?src-supplier=Future+Electronics; ComponentLink3Description: https://datasheet.ciiva.com/17332/rc0805-17332090.pdf?src-supplier=Future+Electronics; ComponentLink4URL: https://datasheet.ciiva.com/2456/pyu-r-int-thick-7-2456377.pdf?src-supplier=Digi-Key; ComponentLink4Description: https://datasheet.ciiva.com/2456/pyu-r-int-thick-7-2456377.pdf?src-supplier=Digi-Key; ComponentLink5URL: https://datasheet.ciiva.com/2456/pyu-r-int-thick-7-2456376.pdf?src-supplier=Digi-Key; ComponentLink5Description: https://datasheet.ciiva.com/2456/pyu-r-int-thick-7-2456376.pdf?src-supplier=Digi-Key; Supplier Part Number 1: 311-330KARCT-ND

## Nets that join several sheets
5V0: [6] - POWER (7 pins), [7] - CONNECTORS (D19.3 D20.3), [8] - SENSORLESS (C16.1 Q4.2 R37.2)
BUS_RX: [1] - MCU-CORE (D1.31 D2.31), [5] - RS485-TRANSCEIVER (R33.1), [7] - CONNECTORS (XT12.3)
BUS_TX: [1] - MCU-CORE (D3.2 D4.2), [5] - RS485-TRANSCEIVER (R31.2 R32.1), [7] - CONNECTORS (XT12.2)
BUTTON1: [1] - MCU-CORE (C5.1 D1.19 R3.1 SB1.2), [7] - CONNECTORS (XT1.1)
BUTTON2: [1] - MCU-CORE (C6.1 D2.19 R4.1 SB2.2), [7] - CONNECTORS (XT4.1)
COUNTER1: [1] - MCU-CORE (R6.1), [7] - CONNECTORS (XT9.2)
COUNTER2: [1] - MCU-CORE (R11.1), [7] - CONNECTORS (XT10.2)
DISP_SCL_1: [1] - MCU-CORE (D1.35 R7.2), [7] - CONNECTORS (D19.1)
DISP_SCL_2: [1] - MCU-CORE (D2.35 R10.2), [7] - CONNECTORS (D20.1)
DISP_SDA_1: [1] - MCU-CORE (D1.34 R9.2), [7] - CONNECTORS (D19.2)
DISP_SDA_2: [1] - MCU-CORE (D2.34 R12.2), [7] - CONNECTORS (D20.2)
GERCON: [1] - MCU-CORE (C3.1 R1.1 R5.1), [7] - CONNECTORS (XT8.1)
GND: [1] - MCU-CORE (21 pins), [3] - MOTOR-CONTROL (8 pins), [4] - MOTOR-DRIVER (17 pins), [5] - RS485-TRANSCEIVER (C9.2 XP1.4 XP1.5), [6] - POWER (12 pins), [7] - CONNECTORS (9 pins), [8] - SENSORLESS (R40.1 R41.2)
MOTOR_OUT1: [3] - MOTOR-CONTROL (D7.1 Q1.3), [7] - CONNECTORS (XT2.2)
MOTOR_OUT2: [3] - MOTOR-CONTROL (D8.1 Q2.3), [7] - CONNECTORS (XT5.2)
PWM_OUT1: [3] - MOTOR-CONTROL (R16.2 U1.7), [7] - CONNECTORS (XT2.3)
PWM_OUT2: [3] - MOTOR-CONTROL (R20.2 U1.5), [7] - CONNECTORS (XT5.3)
PWR: [4] - MOTOR-DRIVER (6 pins), [6] - POWER (D17.4 PT1.1)
PWR_LINE_ADC: [1] - MCU-CORE (D1.20), [6] - POWER (C11.1 R34.1 R36.2)
RS1_OUT1: [4] - MOTOR-DRIVER (D9.1 D13.2 U2.4), [7] - CONNECTORS (XT3.1)
RS1_OUT2: [4] - MOTOR-DRIVER (D10.1 D14.2 U2.5), [7] - CONNECTORS (XT3.2)
RS2_OUT1: [4] - MOTOR-DRIVER (D11.1 D15.2 U2.16), [7] - CONNECTORS (XT6.1)
RS2_OUT2: [4] - MOTOR-DRIVER (D12.1 D16.2 U2.17), [7] - CONNECTORS (XT6.2)
RS485 +: [5] - RS485-TRANSCEIVER (XP1.7), [7] - CONNECTORS (XT7.3)
RS485 -: [5] - RS485-TRANSCEIVER (XP1.6), [7] - CONNECTORS (XT7.4)
S1.1: [7] - CONNECTORS (XT11.1), [8] - SENSORLESS (R38.1)
S1.2: [7] - CONNECTORS (XT11.2), [8] - SENSORLESS (R41.1)
SENSOR1: [1] - MCU-CORE (D1.6), [8] - SENSORLESS (Q4.3 R40.2)
VCC: [1] - MCU-CORE (15 pins), [3] - MOTOR-CONTROL (D7.2 D8.2 U1.6 U1.8), [4] - MOTOR-DRIVER (8 pins), [5] - RS485-TRANSCEIVER (C9.1 R31.1 XP1.1), [6] - POWER (D21.2 D22.2), [7] - CONNECTORS (5 pins)
VCC_24V: [6] - POWER (RT1.1), [7] - CONNECTORS (XT7.1)
NetD1_7: [1] - MCU-CORE (D1.7), [3] - MOTOR-CONTROL (R13.1 R14.2)
NetD1_9: [1] - MCU-CORE (D1.9), [3] - MOTOR-CONTROL (U1.1)
NetD2_7: [1] - MCU-CORE (D2.7), [3] - MOTOR-CONTROL (R17.1 R18.2)
NetD2_9: [1] - MCU-CORE (D2.9), [3] - MOTOR-CONTROL (U1.3)
RS1_EN A: [1] - MCU-CORE (D1.17), [4] - MOTOR-DRIVER (R25.1 U2.8)
RS1_IN1A: [1] - MCU-CORE (D1.12), [4] - MOTOR-DRIVER (R21.1 R27.2 U2.7)
RS1_IN2A: [1] - MCU-CORE (D1.16), [4] - MOTOR-DRIVER (R22.1 R28.2 U2.9)
RS2_EN B: [1] - MCU-CORE (D2.17), [4] - MOTOR-DRIVER (R26.1 U2.14)
RS2_IN3B: [1] - MCU-CORE (D2.12), [4] - MOTOR-DRIVER (R23.1 R29.2 U2.13)
RS2_IN4B: [1] - MCU-CORE (D2.16), [4] - MOTOR-DRIVER (R24.1 R30.2 U2.15)